# EAGLE design pad_v1 (EAGLE 6.5.0)
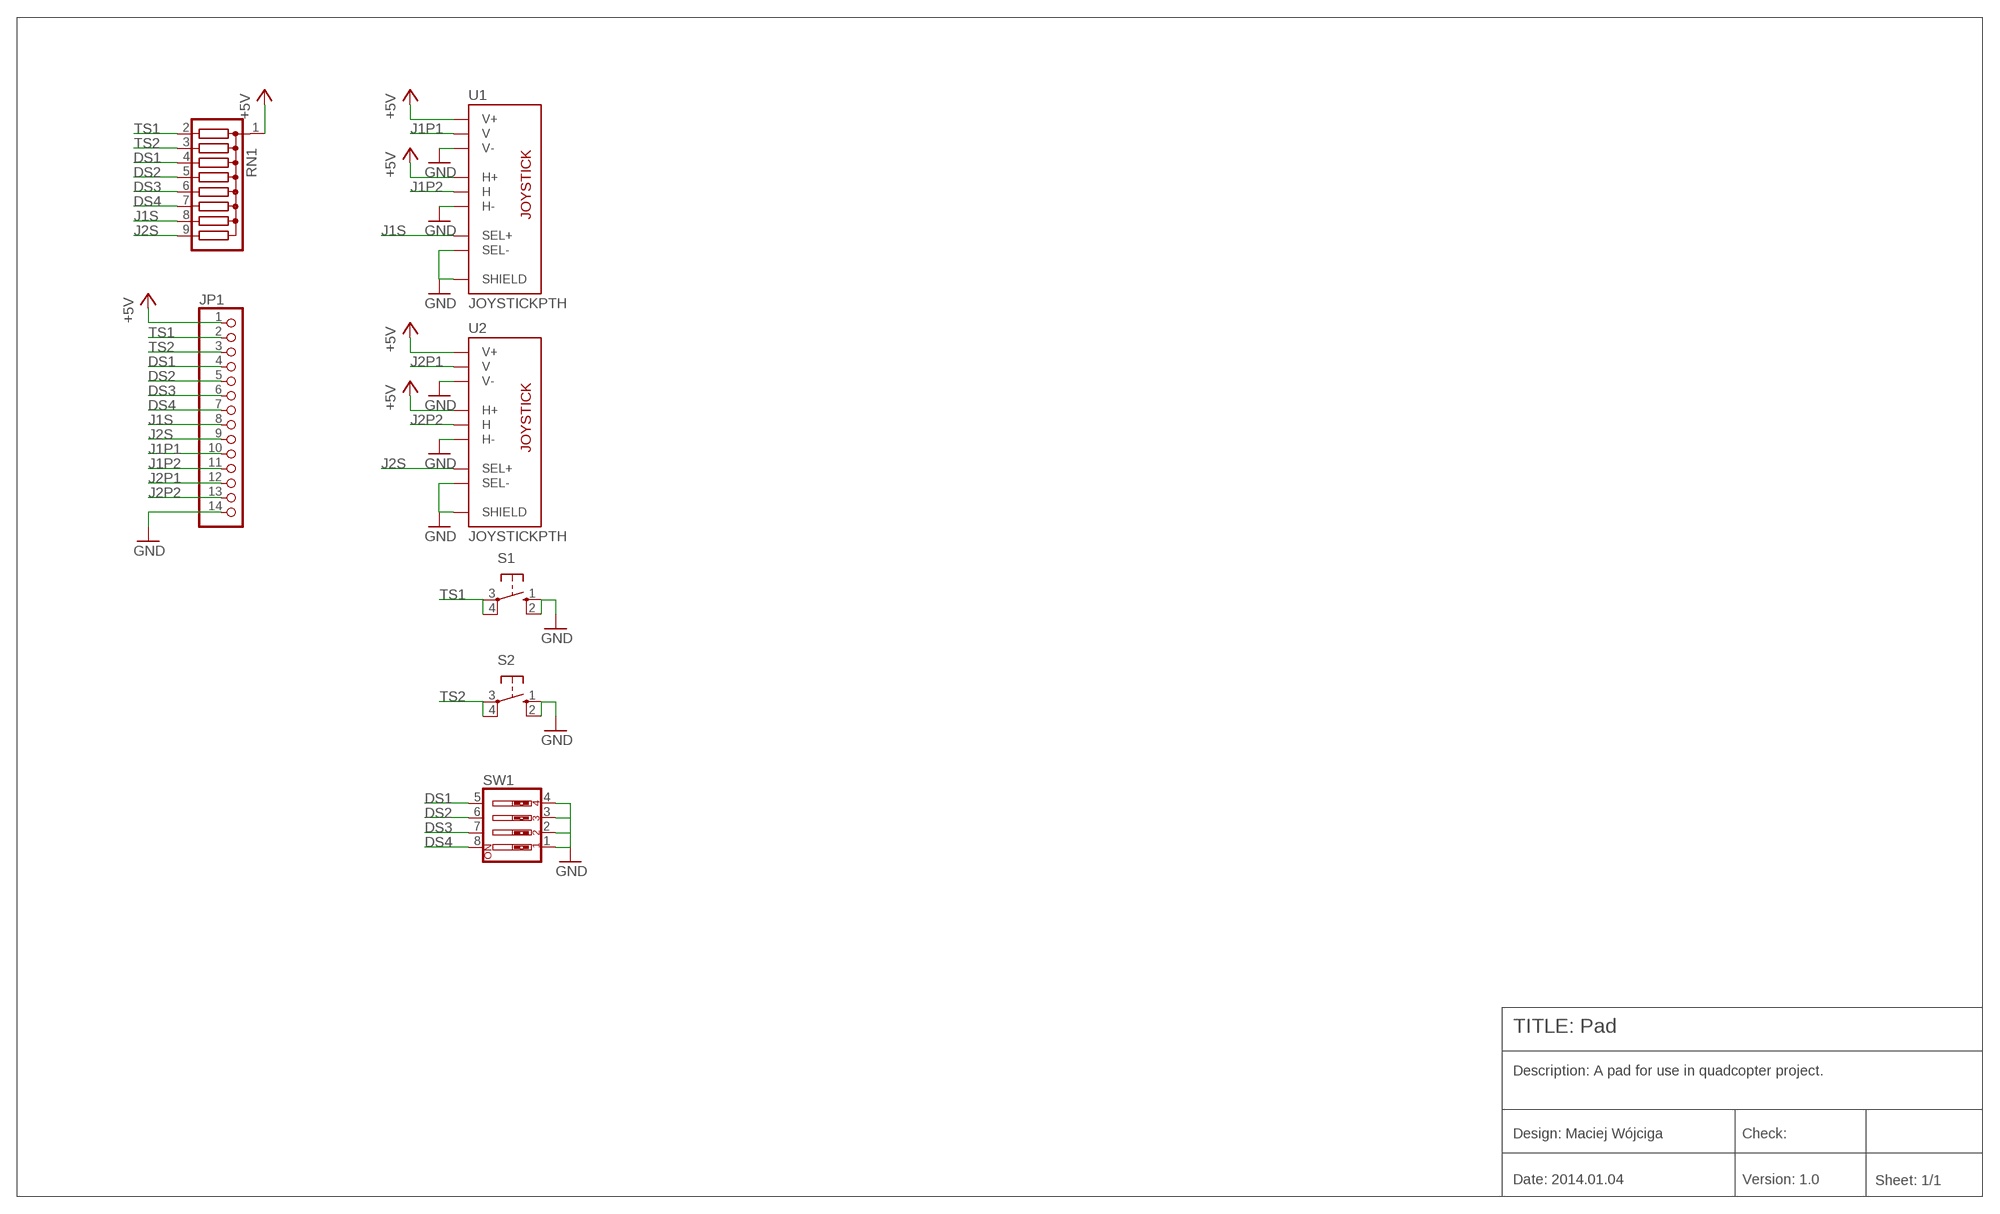
[diagram p0: schematic, sheet 1]

## Parts
JP1  PINHD-1X14  [1X14]
RN1  G08R  [SIL9]
S1  10-XX  [B3F-10XX]
S2  10-XX  [B3F-10XX]
SW1  SW_DIP-4  [EDG-04]
U1  JOYSTICKPTH  [JOYSTICK]
U2  JOYSTICKPTH  [JOYSTICK]

## Nets
+5V: JP1.1 RN1.1 U1.H1(H+) U1.V1(V+) U2.H1(H+) U2.V1(V+)
DS1: JP1.4 RN1.4 SW1.5
DS2: JP1.5 RN1.5 SW1.6
DS3: JP1.6 RN1.6 SW1.7
DS4: JP1.7 RN1.7 SW1.8
GND: JP1.14 S1.1(S) S1.2(S1) S2.1(S) S2.2(S1) SW1.1 SW1.2 SW1.3 SW1.4 U1.B2A(SEL-) U1.B2B(SEL-) U1.H3(H-) U1.MOUNT1(SHIELD) U1.MOUNT2(SHIELD) U1.MOUNT3(SHIELD) U1.MOUNT4(SHIELD) U1.V3(V-) U2.B2A(SEL-) U2.B2B(SEL-) U2.H3(H-) U2.MOUNT1(SHIELD) U2.MOUNT2(SHIELD) U2.MOUNT3(SHIELD) U2.MOUNT4(SHIELD) U2.V3(V-)
J1P1: JP1.10 U1.V2(V)
J1P2: JP1.11 U1.H2(H)
J1S: JP1.8 RN1.8 U1.B1A(SEL+) U1.B1B(SEL+)
J2P1: JP1.12 U2.V2(V)
J2P2: JP1.13 U2.H2(H)
J2S: JP1.9 RN1.9 U2.B1A(SEL+) U2.B1B(SEL+)
TS1: JP1.2 RN1.2 S1.3(P) S1.4(P1)
TS2: JP1.3 RN1.3 S2.3(P) S2.4(P1)

## Notes on the sheet
- TITLE: Pad
- Description: A pad for use in quadcopter project.
- Design: Maciej Wójciga | Check:
- Date: 2014.01.04 | Version: 1.0 | Sheet: 1/1

## Library data of the parts
JP1 = adafruit:PINHD-1X14: PIN HEADER
RN1 = resistor-sil:G08R: SIL RESISTOR; OC_FARNELL: unknown; OC_NEWARK: unknown
S1 S2 = switch-omron:10-XX: OMRON SWITCH; MPN: B3F-1000; OC_FARNELL: 176432; OC_NEWARK: 36M3542
SW1 = special:SW_DIP-4: DIP SWITCH
U1 U2 = adafruit:JOYSTICK: Thumb Joystick Joystick commonly found in PS2 controllers. Two pots and a select switch. Adapted from Sparkfun Library (but for more common 6mm switch sticks)

## Net classes
0 default: width 0.203 mm

## Board
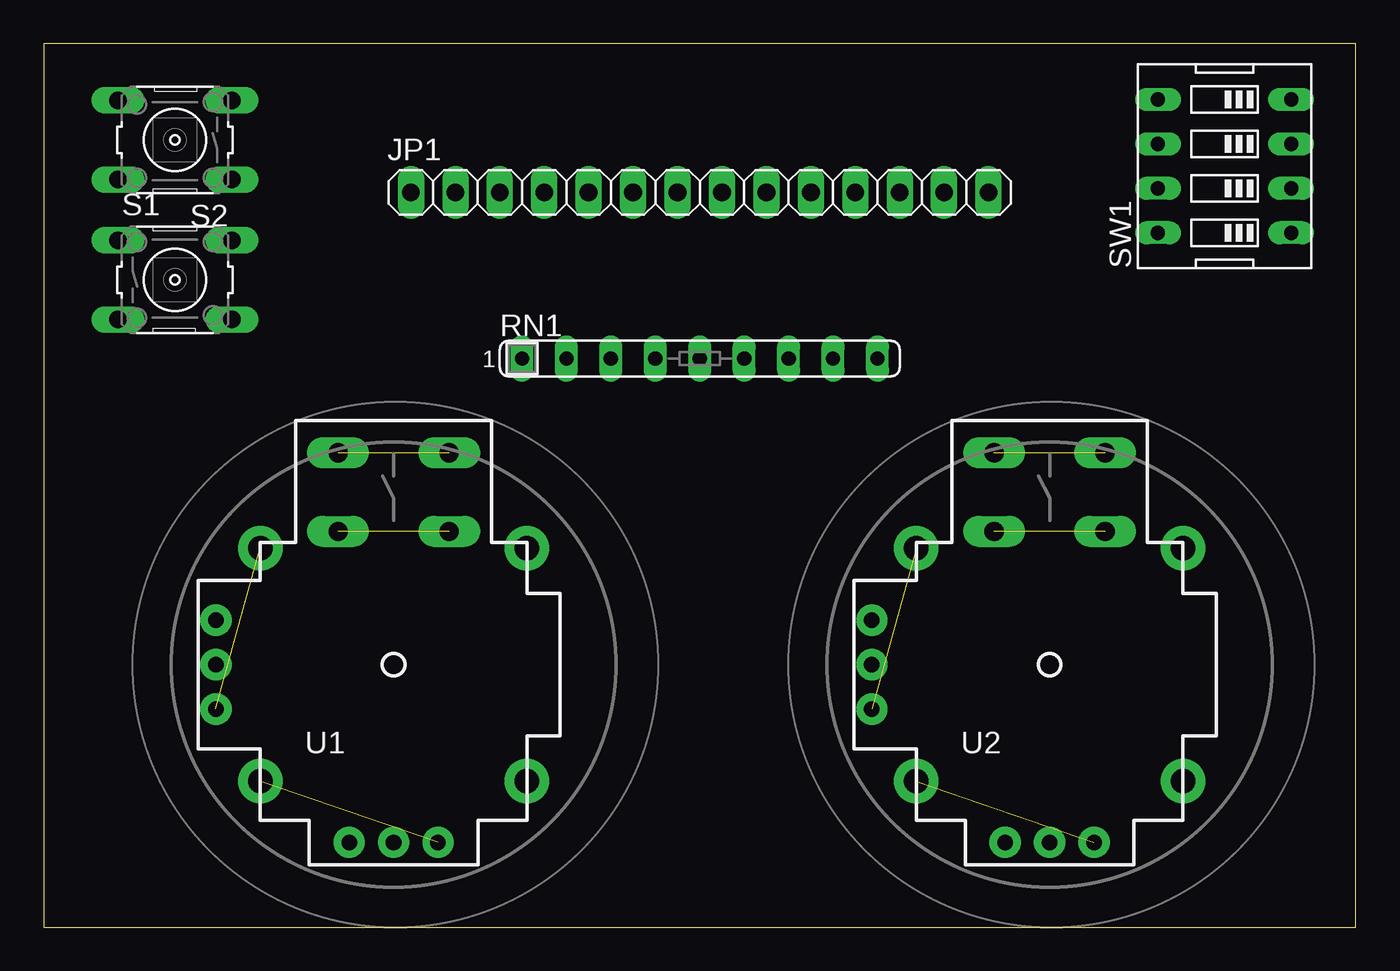
[diagram p1: board, top side]
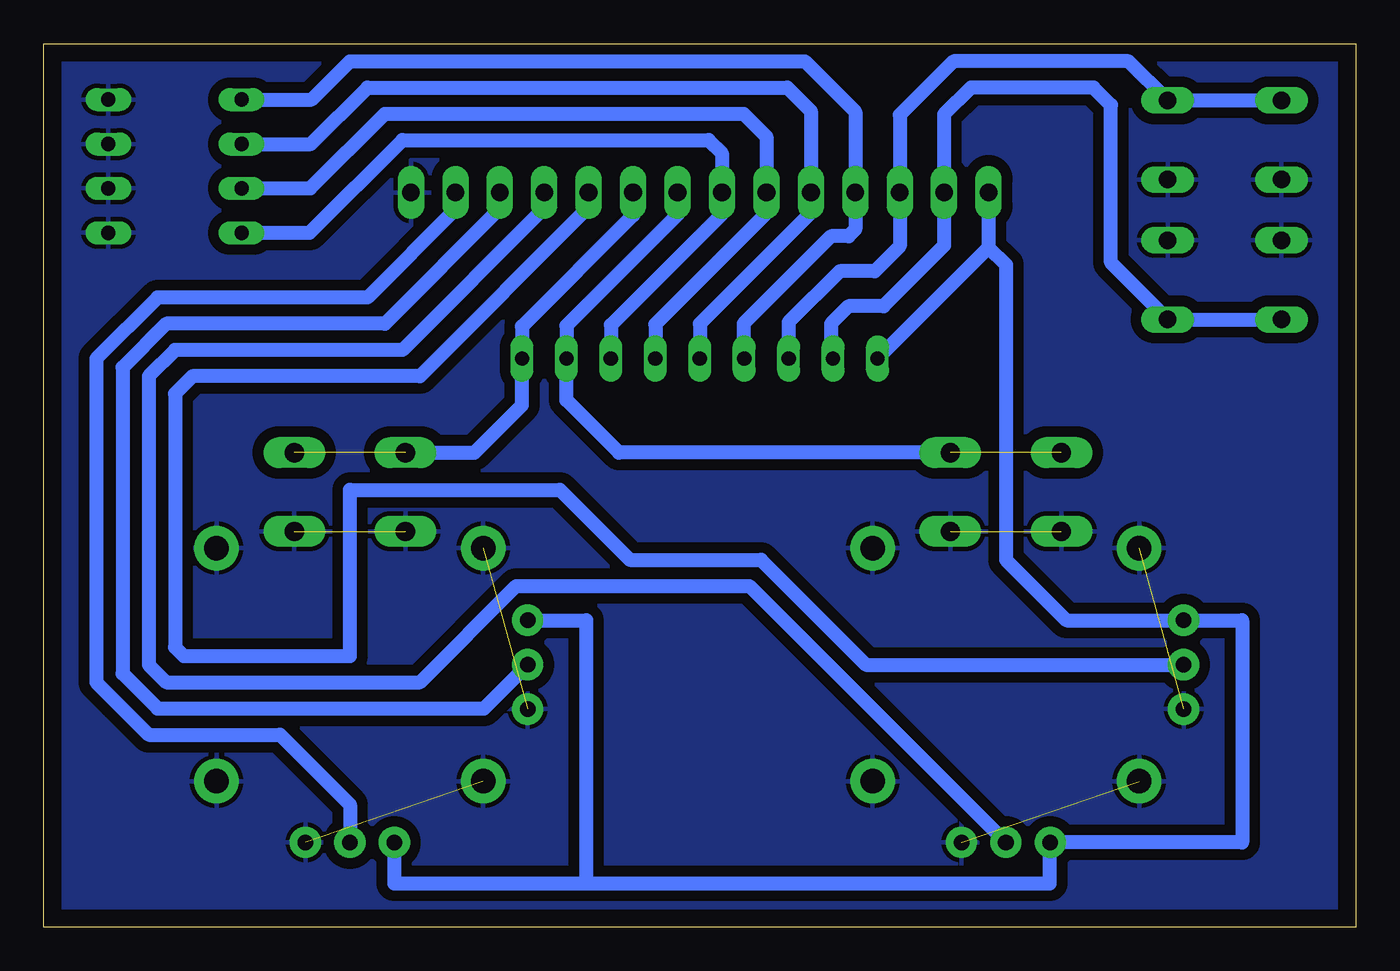
[diagram p2: board, bottom side, seen from below]

Size 75 x 50.5 mm. Coordinates in mm from the lower left corner, seen from the top.
Outline: 0,0 75,0 75,50.5 0,50.5 0,0
Copper layers (1*16): Top 0.035mm / dielectric 1.5mm / Bottom 0.035mm
Design rules "default": minimum track width 10mil, minimum drill 24mil, track to track 8mil, track to pad 8mil, pad to pad 8mil, via to via 8mil, smd to smd 8mil, copper to edge 40mil, drill to drill 8mil, minimum pad ring 10mil, minimum via ring 8mil, stop-mask expansion 4mil, vias tented up to drill 0mil, thermal gap 10mil

### Footprints (pad centres in the part's own frame; a part is rotated, then mirrored left to right if it is on the bottom)
1X14 = drill 1.016 long: 1 -16.51,0; 2 -13.97,0; 3 -11.43,0; 4 -8.89,0; 5 -6.35,0; 6 -3.81,0; 7 -1.27,0; 8 1.27,0; 9 3.81,0; 10 6.35,0; 11 8.89,0; 12 11.43,0; 13 13.97,0; 14 16.51,0
SIL9 = drill 0.813 long: 1 -10.16,0; 2 -7.62,0; 3 -5.08,0; 4 -2.54,0; 5 0,0; 6 2.54,0; 7 5.08,0; 8 7.62,0; 9 10.16,0
B3F-10XX = drill 1.016 long: 1 -3.251,2.261; 2 3.251,2.261; 3 -3.251,-2.261; 4 3.251,-2.261
EDG-04 = drill 0.813 long: 1 -3.81,-3.81; 2 -1.27,-3.81; 3 1.27,-3.81; 4 3.81,-3.81; 5 3.81,3.81; 6 1.27,3.81; 7 -1.27,3.81; 8 -3.81,3.81
JOYSTICK = drill 1.1 pad 1.778 long: B1A -3.175,12.12; B1B 3.175,12.12; B2A -3.175,7.62; B2B 3.175,7.62 | drill 0.889 pad 1.778: H1 -2.54,-10.16; H2 0,-10.16; H3 2.54,-10.16; V1 -10.16,2.54; V2 -10.16,0; V3 -10.16,-2.54 | drill 1.397 pad 2.54: MOUNT1 -7.62,6.668; MOUNT2 -7.62,-6.668; MOUNT3 7.62,-6.668; MOUNT4 7.62,6.668

### Placement (x,y rotation side)
JP1  37.5,42 0 top
RN1  37.5,32.5 0 top
S1  7.5,37 0 top
S2  7.5,45 180 top
SW1  67.5,43.5 90 top
U1  20,15 0 top
U2  57.5,15 0 top

### Tracks (layer width: path | path; a pad name or v marks a point on that pad's centre or on a via)
+5V
  Bottom 0.813: JP1.1 20.99,38.85 | 20.99,38.85 RN1.1 | U2.H1 54.96,2.5 44,2.5 | 44,2.5 17.5,2.5 17.5,4.84 U1.H1 6.5,4.84 6.5,17.54 U1.V1 16.54,17.54 20,21 20,37.86 20.99,38.85 | U2.V1 44,17.54 44,2.5
DS1
  Bottom 0.813: RN1.4 35,32.54 35,34.5 30,39.5 29,39.5 28.61,39.89 JP1.4 28.61,46.61 31.5,49.5 57.5,49.5 59.69,47.31 SW1.5
DS2
  Bottom 0.813: RN1.5 37.5,34.5 31.15,40.85 JP1.5 31.15,46.65 32.5,48 56.5,48 59.73,44.77 SW1.6
DS3
  Bottom 0.813: RN1.6 40.04,34.46 33.69,40.81 JP1.6 33.69,45.19 35,46.5 55.5,46.5 59.77,42.23 SW1.7
DS4
  Bottom 0.813: RN1.7 42.58,34.42 36.23,40.77 JP1.7 36.23,44.23 37,45 54.5,45 59.81,39.69 SW1.8
GND  (6 unrouted)
  pour Bottom (isolate 0.61): 0,50.5 75,50.5 75,0 0,0
J1P1
  Bottom 0.813: JP1.10 43.85,41.15 53.5,31.5 66.5,31.5 67.5,30.5 67.5,16 67,15.5 57.5,15.5 57.5,25 45.5,25 41.5,21 34,21 28,15 U1.V2
J1P2
  Bottom 0.813: JP1.11 46.39,41.11 54.5,33 67.5,33 69,31.5 69,15 68,14 53.5,14 48,19.5 34.66,19.5 U1.H2
J1S  (1 unrouted)
  Bottom 0.813: JP1.8 38.77,40.73 45.12,34.38 RN1.8 45.12,30.12 42.12,27.12 U1.B1B
J2P1
  Bottom 0.813: JP1.12 48.93,41.07 55.5,34.5 68,34.5 70.5,32 70.5,14.5 68.5,12.5 49.84,12.5 U2.V2
J2P2
  Bottom 0.813: JP1.13 51.47,41.03 56.5,36 68.5,36 72,32.5 72,14 69,11 61.5,11 57.5,7 U2.H2
J2S  (1 unrouted)
  Bottom 0.813: JP1.9 41.31,40.69 47.66,34.34 RN1.9 47.66,29.84 50.38,27.12 U2.B1A
TS1
  Bottom 0.813: RN1.2 30,32.62 30,34.5 29,35.5 27,35.5 23.53,38.97 JP1.2 23.53,46.47 22,48 15,48 14,47 14,37.99 S1.4 S1.3
TS2
  Bottom 0.813: RN1.3 32.42,34.58 29.5,37.5 27.5,37.5 26.07,38.93 JP1.3 26.07,46.43 23,49.5 12.99,49.5 S2.3 S2.4